# Altium schematic sheet Schemtaic Sheet 2.SchDoc
size A4; SheetNumber: 1; SheetTotal: 3
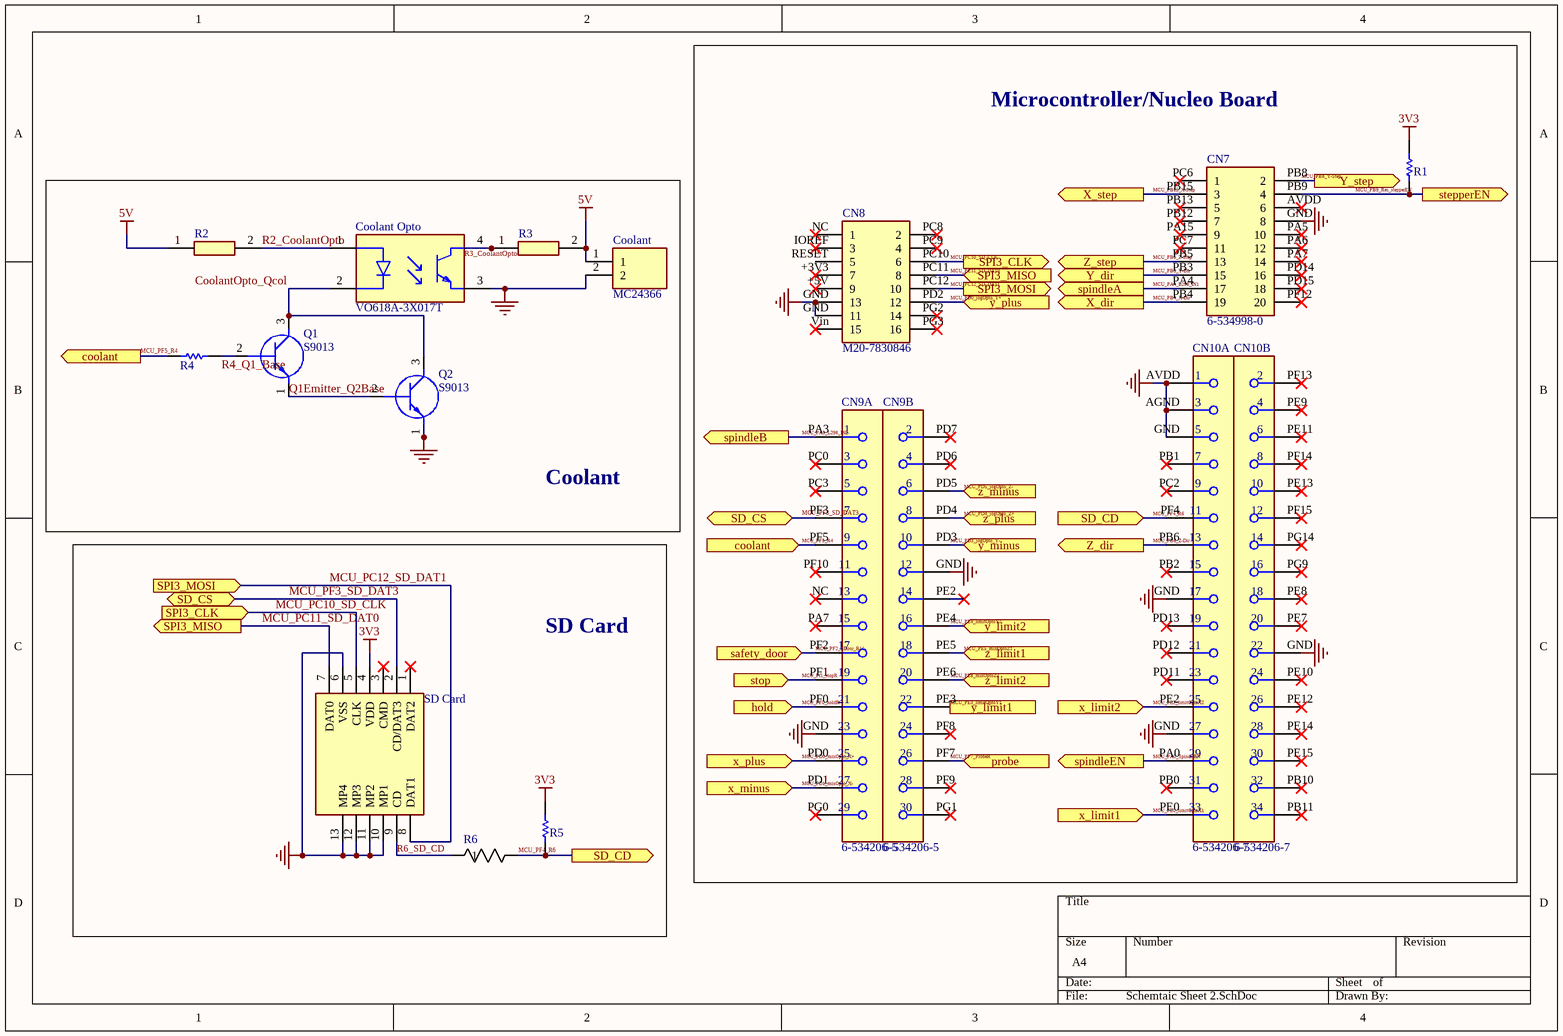
[diagram p0: Schemtaic Sheet 2.SchDoc]

## Parts
CN7  6-534998-0  [RHDR20W77P254X254_2X10_2540X503X673P]
CN8  M20-7830846  [RHDR16W70P254_2X8_2072X504X865P]
CN9  6-534206-5  [FP-6-534206-5-MFG]  (parts A,B of 2)
CN10  6-534206-7  [FP-6-534206-7-MFG]  (parts A,B of 2)
Coolant  MC24366  [Model Name]
Coolant_Opto  VO618A-3X017T  [FP-VO618A-3X017T-MFG]
Q1  S9013  [MJE13001TP]
Q2  S9013  [MJE13001TP]
R1  MFR-25FBF5210K  [RESA60-630X240]  (value not drawn)
R2  KNP100JB-73-75R  [RESAD2990W85L1150D460]  (value not drawn)
R3  MBB02070C9109FCT00  [RESAD1650W63L650D250]  (value not drawn)
R4  MFR-25FBF5210K  [RESA60-630X240]  (value not drawn)
R5  MFR-25FBF5210K  [RESA60-630X240]  (value not drawn)
R6  AC01000004700JA100  [RES_AC01_VIS]  (value not drawn)
SD_Card  MEM2075-00-140-01-A  [MEM20750014001A]  (value not drawn)

## Blocks framed on the sheet
Microcontroller/Nucleo Board: CN7-CN10 R1
Coolant: Coolant Coolant_Opto Q1 Q2 R2-R4
SD Card: R5 R6 SD_Card

## Ports
coolant (in, see Schemtaic Sheet 2[1B]), coolant (out, see Schemtaic Sheet 2[2C]), hold (in, see Schemtaic Sheet 4[3C]), probe (in, see Schemtaic Sheet 4[4A]), safety_door (in, see Schemtaic Sheet 4[3C]), SD_CD (in, see Schemtaic Sheet 2[2D]), SD_CD (out, see Schemtaic Sheet 2[3C]), SD_CS (bidir, see Schemtaic Sheet 2[1C]), SD_CS (bidir, see Schemtaic Sheet 2[2C]), SPI3_CLK (in, see Schemtaic Sheet 2[3B]), SPI3_CLK (out, see Schemtaic Sheet 2[1C]), SPI3_MISO (in, see Schemtaic Sheet 2[1C]), SPI3_MISO (out, see Schemtaic Sheet 2[3B]), SPI3_MOSI (in, see Schemtaic Sheet 2[3B]), SPI3_MOSI (out, see Schemtaic Sheet 2[1C]), spindleA (out, see Schemtaic Sheet 4[2C]), spindleB (out, see Schemtaic Sheet 4[2C]), spindleEN (out, see Schemtaic Sheet 4[2C]), stepperEN (out, see Schemtaic Sheet 4[1C], Schemtaic Sheet 4[2C]), stop (in, see Schemtaic Sheet 4[3B]), X_dir (out, see Schemtaic Sheet 4[1C]), x_limit1 (in, see Schemtaic Sheet 3[1D]), x_limit2 (in, see Schemtaic Sheet 3[1D]), x_minus (in, see Schemtaic Sheet 3[3D]), x_plus (in, see Schemtaic Sheet 3[3D]), X_step (out, see Schemtaic Sheet 4[1C]), Y_dir (out, see Schemtaic Sheet 4[1D]), y_limit1 (in, see Schemtaic Sheet 3[1D]), y_limit2 (in, see Schemtaic Sheet 3[1D]), y_minus (in, see Schemtaic Sheet 3[4D]), y_plus (in, see Schemtaic Sheet 3[4D]), Y_step (out, see Schemtaic Sheet 4[1D]), Z_dir (out, see Schemtaic Sheet 4[2C]), z_limit1 (in, see Schemtaic Sheet 3[3D]), z_limit2 (in, see Schemtaic Sheet 3[3D]), z_minus (in, see Schemtaic Sheet 3[4C]), z_plus (in, see Schemtaic Sheet 3[4D]), Z_step (out, see Schemtaic Sheet 4[2C])

## Nets
3V3: R1.2 R5.2 SD_Card.4(VDD)
5V: Coolant.1 R2.1 R3.2
GND: CN7.GND(8) CN8.GND(13) CN9.GND CN10.AGND CN10.AVDD CN10.GND Coolant.2 Coolant_Opto.3(E) Q2.1(E) SD_Card.6(VSS) SD_Card.10(MP1) SD_Card.11(MP2) SD_Card.12(MP3) SD_Card.13(MP4)
CoolantOpto_Qcol: Coolant_Opto.2(C) Q1.3(C) Q2.3(C)
MCU_PA0_SpindleEN: CN10.PA0 ; port spindleEN
MCU_PA3_L298_IN2: CN9.PA3 ; port spindleB
MCU_PA4_L298_IN1: CN7.PA4(17) ; port spindleA
MCU_PB3_Y-Dir: CN7.PB3(15) ; port Y_dir
MCU_PB4_X-Dir: CN7.PB4(19) ; port X_dir
MCU_PB5_Z-Step: CN7.PB5(13) ; port Z_step
MCU_PB6_Z-Dir: CN10.PB6 ; port Z_dir
MCU_PB8_Y-Step: CN7.PB8(2) ; port Y_step
MCU_PB9_Res_stepperEN: CN7.PB9(4) R1.1 ; port stepperEN
MCU_PB15_X-Step: CN7.PB15(3) ; port X_step
MCU_PC10_SD_CLK: CN8.PC10(6) SD_Card.5(CLK) ; port SPI3_CLK
MCU_PC11_SD_DAT0: CN8.PC11(8) SD_Card.7(DAT0) ; port SPI3_MISO
MCU_PC12_SD_DAT1: CN8.PC12(10) SD_Card.8(DAT1) ; port SPI3_MOSI
MCU_PD0_jogOpto_Y+: CN8.PD2(12) ; port y_plus
MCU_PD0_mixOpto_X+: CN9.PD0 ; port x_plus
MCU_PD1_mixOpto_X-: CN9.PD1 ; port x_minus
MCU_PD3_jogOpto_Y-: CN9.PD3 ; port y_minus
MCU_PD4_jogOpto_Z+: CN9.PD4 ; port z_plus
MCU_PD5_jogOpto_Z-: CN9.PD5 ; port z_minus
MCU_PE0_limitOptoX1: CN10.PE0 ; port x_limit1
MCU_PE2_limitOptoX2: CN10.PE2 ; port x_limit2
MCU_PE3_limitOptoY1: CN9.PE3 ; port y_limit1
MCU_PE4_limitOptoY2: CN9.PE4 ; port y_limit2
MCU_PE5_mixOptoZ1: CN9.PE5 ; port z_limit1
MCU_PE8_mixOptoZ2: CN9.PE6 ; port z_limit2
MCU_PF0_holdR: CN9.PF0 ; port hold
MCU_Pf1_stopR: CN9.PF1 ; port stop
MCU_PF2_SDoor_R11: CN9.PF2 ; port safety_door
MCU_PF3_SD_DAT3: CN9.PF3 SD_Card.2(CD/DAT3) ; port SD_CS
MCU_PF4_R6: CN10.PF4 R5.1 R6.2 ; port SD_CD
MCU_PF5_R4: CN9.PF5 R4.1 ; port coolant
MCU_PF7_ProbeR: CN9.PF7 ; port probe
Q1Emitter_Q2Base: Q1.1(E) Q2.2(B)
R2_CoolantOpto: Coolant_Opto.1(A) R2.2
R3_CoolantOpto: Coolant_Opto.4(C) R3.1
R4_Q1_Base: Q1.2(B) R4.2
R6_SD_CD: R6.1 SD_Card.9(CD)

Not connected (* = marked no-connect by the designer): CN7 AVDD(6)* PA5(10)* PA6(12)* PA7(14)* PA15(9)* PB12(7)* PB13(5)* PC6(1)* PC7(11)* PD14(16)* PD15(18)* PF12(20)*; CN8 +3V3(7)* +5V(9)* IOREF(3)* NC(1)* PC8(2)* PC9(4)* PG2(14)* PG3(16)* RESET(5) Vin(15)*; CN9 NC(13)* PA7(15)* PC0(3)* PC3(5)* PD6(4)* PD7(2)* PE2(14)* PF8(24)* PF9(28)* PF10(11)* PG0(29)* PG1(30)*; CN10 PB0(31)* PB1(7)* PB2(15)* PB10(32)* PB11(34)* PC2(9)* PD11(23)* PD12(21)* PD13(19)* PE7(20)* PE8(18)* PE9(4)* PE10(24)* PE11(6)* PE12(26)* PE13(10)* PE14(28)* PE15(30)* PF13(2)* PF14(8)* PF15(12)* PG9(16)* PG14(14)*; SD_Card 1(DAT2)* 3(CMD)*

## Library data of the parts
CN7 = 6-534998-0: Connector; Manufacturer_Name: TE Connectivity; Datasheet Link: http://www.te.com/commerce/DocumentDelivery/DDEController?Action=showdoc&DocId=Catalog+Section%7F1307819_SECTION_5%7F0908%7Fpdf%7FEnglish%7FENG_CS_1307819_SECTION_5_0908.pdf%7F6-534998-0; Height: 6.73mm; Manufacturer_Part_Number: 6-534998-0; Mouser Part Number: 571-6-534998-0; Mouser Price/Stock: https://www.mouser.co.uk/ProductDetail/TE-Connectivity/6-534998-0?qs=xDp7PGUNC%252BtlNIlh1MxdbQ%3D%3D; Arrow Part Number: 6-534998-0; Arrow Price/Stock: https://www.arrow.com/en/products/6-534998-0/te-connectivity
CN8 = M20-7830846: Connector; Manufacturer_Name: Harwin; Datasheet Link: https://cdn.harwin.com/pdfs/M20-783.pdf; Height: 8.65mm; Manufacturer_Part_Number: M20-7830846; Mouser Part Number: 855-M20-7830846; Mouser Price/Stock: https://www.mouser.co.uk/ProductDetail/Harwin/M20-7830846?qs=vF78I%252BjhbY9RWFQV7oNW%252BQ%3D%3D
CN9 = CMP-03369-000056-1: CONN RCPT 30POS 0.1 GOLD PCB; Manufacturer: TE; Number Of Contacts: 30; Is Female: yes; Pitch: 2.54mm; Conn Gender: Female; Standoff Height: 0.38mm; Conn Orientation: Vertical; Current Rating: 2A; Lead Free: Yes; Category: Conn; Mouser Description: Headers & Wire Housings REC 2X15P VRT T/H; Device Class L3: unset; Height: 8.9mm; ComponentLink2Description: Datasheet; Manufacturer Part Number: 6-534206-5; RoHS: TRUE; ComponentLink2URL: https://www.te.com/commerce/DocumentDelivery/DDEController?Action=showdoc&DocId=Specification+Or+Standard%7F114-25018%7FE%7Fpdf%7FEnglish%7FENG_SS_114-25018_E.pdf%7F6-534206-5; Temperature: -65°C to +105°C; Temperature Range Low: -65°C; Footprint Url: https://www.te.com/commerce/DocumentDelivery/DDEController?Action=showdoc&DocId=Customer+Drawing%7F534206%7FR7%7Fpdf%7FEnglish%7FENG_CD_534206_R7.pdf%7F6-534206-5; Contact Material: Gold,Nickel; Automotive: No; Package: 0; Device Class L2: Headers and Wire Housings; Device Class L1: Connectors; Temperature Range High: +105°C; Number Of Rows: 2; Digikey Description: CONN RCPT 30POS 0.1 GOLD PCB; Octopart: https://octopart.com/6-534206-5-te+connectivity-39516817
CN10 = CMP-03369-000075-1: CONN RCPT 34POS 0.1 GOLD PCB; Manufacturer: TE Connectivity; Pitch: 2.54mm; Number Of Contacts: 34; Standoff Height: 0.38mm; Conn Gender: Female; Conn Orientation: Vertical; Is Female: yes; Current Rating: 2A; Voltage Rating: 333V; Number Of Rows: 2; RoHS: TRUE; Lead Free: Yes; Contact Material: Gold,Nickel; Device Class L3: unset; Octopart: https://octopart.com/6-534206-7-te+connectivity-39516825; Automotive: No; Mouser Description: Headers & Wire Housings REC 2X17P VRT T/H; Temperature Range Low: -65°C; Device Class L1: Connectors; Footprint Url: https://www.te.com/commerce/DocumentDelivery/DDEController?Action=showdoc&DocId=Customer+Drawing%7F534206%7FR7%7Fpdf%7FEnglish%7FENG_CD_534206_R7.pdf%7F6-534206-7; ComponentLink2URL: https://www.te.com/commerce/DocumentDelivery/DDEController?Action=showdoc&DocId=Specification+Or+Standard%7F114-25018%7FE%7Fpdf%7FEnglish%7FENG_SS_114-25018_E.pdf%7F6-534206-7; Temperature: -65°C to +105°C; Device Class L2: Headers and Wire Housings; Height: 8.9mm; Temperature Range High: +105°C; Digikey Description: CONN RCPT 34POS 0.1 GOLD PCB; Manufacturer Part Number: 6-534206-7; Category: Conn; Package: 6-534206-7; ComponentLink2Description: Datasheet
Coolant = MC24366: TERMINAL BLOCK, WIRE TO BRD, 2POS, 12AWG; Manufacturer_Name: MULTICOMP; Geometry.Height: 14.3mm; Manufacturer_Part_Number: MC24366; Mouser Part Number: *; Mouser Price/Stock: *; Arrow Part Number: *; Arrow Price/Stock: *; Datasheet Link: *
Coolant_Opto = CMP-02521-000022-1: OPTOISOLATOR 5.3KV TRANS 4-SMD; Max Power Dissipation: 150mW; Collector-emitter Voltage-Max: 400mV; Number of Elements: 1; Forward Voltage: 1.1V; Max Collector Current: 50mA; Collector Emitter Voltage (VCEO): 80V; Current Transfer Ratio: 100%; Forward Current: 60mA; Reverse Breakdown Voltage: 6V; Input Type: DC; Series: -; Mount: Surface Mount; Isolation Voltage: 5.3kV; Contact Plating: Tin; Max Output Voltage: 80V; Package Quantity: 1; RoHS Compliant: Yes; Min Operating Temperature: -55°C; Power Dissipation: 150mW; Max Operating Temperature: 110°C; Radiation Hardening: No; Packaging: Tape and Reel; Max Input Current: 60mA; Output Current per Channel: 50mA; Number of Pins: 4; Case/Package: SMD/SMT; Number of Channels: 1; Lead Free: Lead Free; Collector Emitter Saturation Voltage: 400mV; Input Current: 60mA
Q1 Q2 = S9013: Transistor BJT NPN; Manufacturer_Name: MCC; Datasheet Link: https://datasheet.datasheetarchive.com/originals/distributors/Datasheets-19/DSA-361984.pdf; Height: 6.5mm; Manufacturer_Part_Number: S9013
R1 R4 R5 = CMP-1659-00074-2: Axial Resistor, 10 KOhm, +/- 1%, 0.25 W, -55 to 155 degC, 2-Pin THD, RoHS, Bulk; Manufacturer: Yageo; Temperature Coefficient: 100ppm\/degreesC; Voltage Rating: 250V; Voltage Rating (DC): 200V; Resistance: 10KOhm; Max Power Dissipation: 250mW; Datasheet URL: http://www.yageo.com/documents/recent/Yageo%20LR_MFR_2013.pdf; Packaging: Bulk; RoHSCompliant: True; Mount: ThroughHole; Package Reference: MFR-25; Termination: Axial; Composition: MetalFilm; Number of Terminations: 2; Package Quantity: 200; Mounting Technology: ThroughHole; Length: 0.248inch; Max Operating Temperature: 155degC; Min Operating Temperature: -55degC; Datasheet Version: 04/2013; Lead Free: LeadFree; Manufacturer URL: http://www.yageo.com/; Tolerance: 1%; Power Rating: 250mW; Package Description: 2-Pin Axial Lead, Dia 2.4 mm, Body Length 6.3 mm; Military Standard: Not; Case\/Package: Axial
R2 = KNP100JB-73-75R: Resistor; Manufacturer_Name: YAGEO; Datasheet Link: https://www.arrow.com/en/products/knp100jb-73-75r/yageo?region=nac; Manufacturer_Part_Number: KNP100JB-73-75R
R3 = MBB02070C9109FCT00: Resistor; Manufacturer_Name: Vishay; Datasheet Link: https://www.vishay.com/docs/28766/mbxsma.pdf; Manufacturer_Part_Number: MBB02070C9109FCT00
R6 = CMP-00030-42521877-1: AC01000004700JA100 VISHAY AC01000004700JA100 Through Hole Resistor, 470 ohm, Axial Leaded, 1 W, 5%, AC Series; Temperature Coefficient: 180ppm/°C; Voltage Rating (DC): 22V; Max Power Dissipation: 1W; Resistance: 470Ω; Lead Diameter: 800µm; Max Operating Temperature: 200°C; Number of Pins: 2; Weight: 519.986953mg; Contact Plating: Tin; Radiation Hardening: No; Number of Terminations: 2; Military Standard: Not; REACH SVHC: Unknown; Packaging: Cut Tape (CT); Tolerance: 5%; Composition: Wirewound; NexarPartId: 42521877; Case/Package: Conformal; Termination: Axial; Power Rating: 1W; RoHS: Compliant; Length: 11mm; Min Operating Temperature: 0°C; Diameter: 4.3mm
SD_Card = MEM2075-00-140-01-A: Connector; Manufacturer_Name: GCT (GLOBAL CONNECTOR TECHNOLOGY); Datasheet Link: http://www.farnell.com/cad/2606866.pdf; Manufacturer_Part_Number: MEM2075-00-140-01-A; Mouser Part Number: 640-MEM20750014001A; Mouser Price/Stock: https://www.mouser.co.uk/ProductDetail/GCT/MEM2075-00-140-01-A?qs=KUoIvG%2F9IlZvfWpeERlq3Q%3D%3D